# Altium schematic sheet ESP8266_final.SchDoc
size A2; SheetNumber: 1; SheetTotal: 3
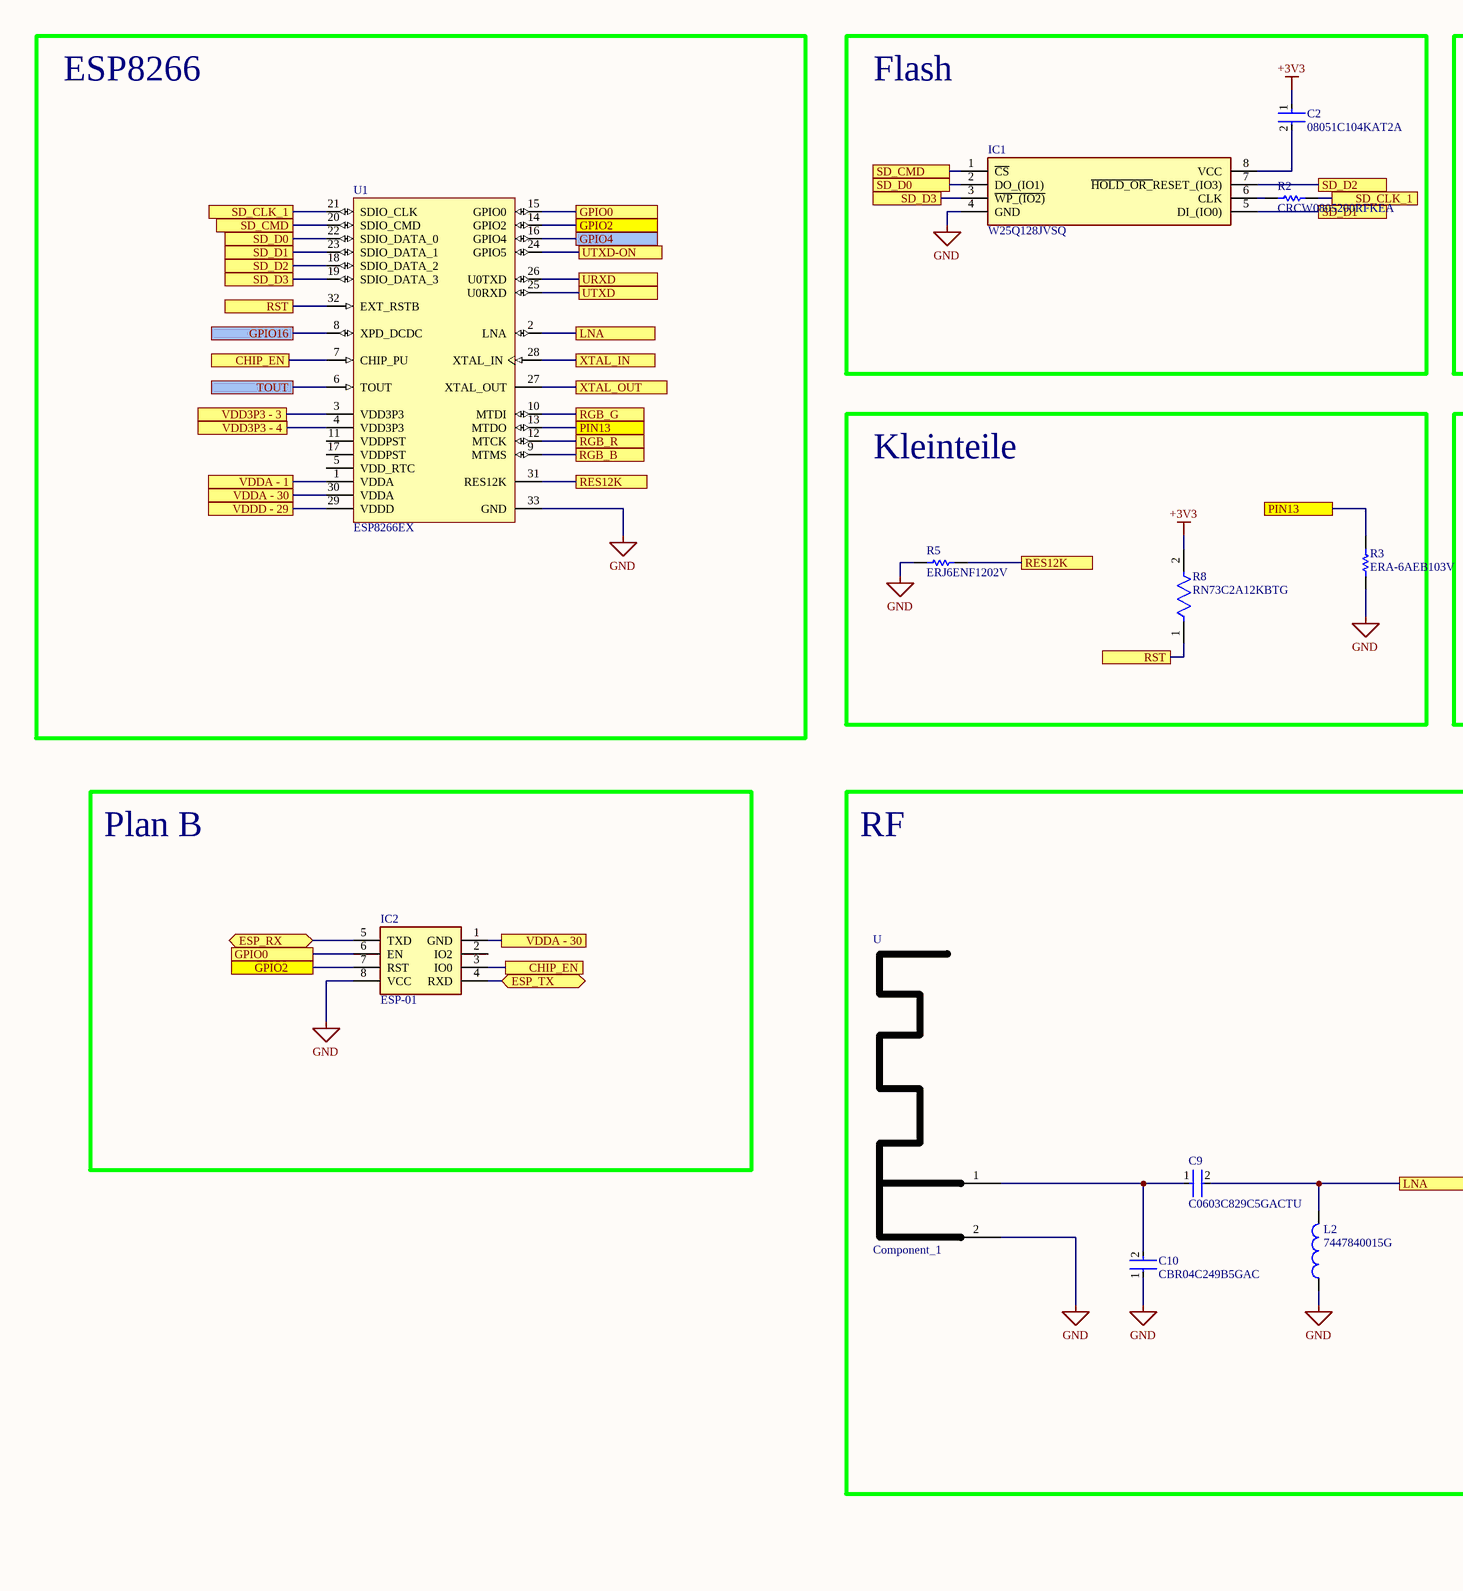
[diagram p0: ESP8266_final.SchDoc, left]
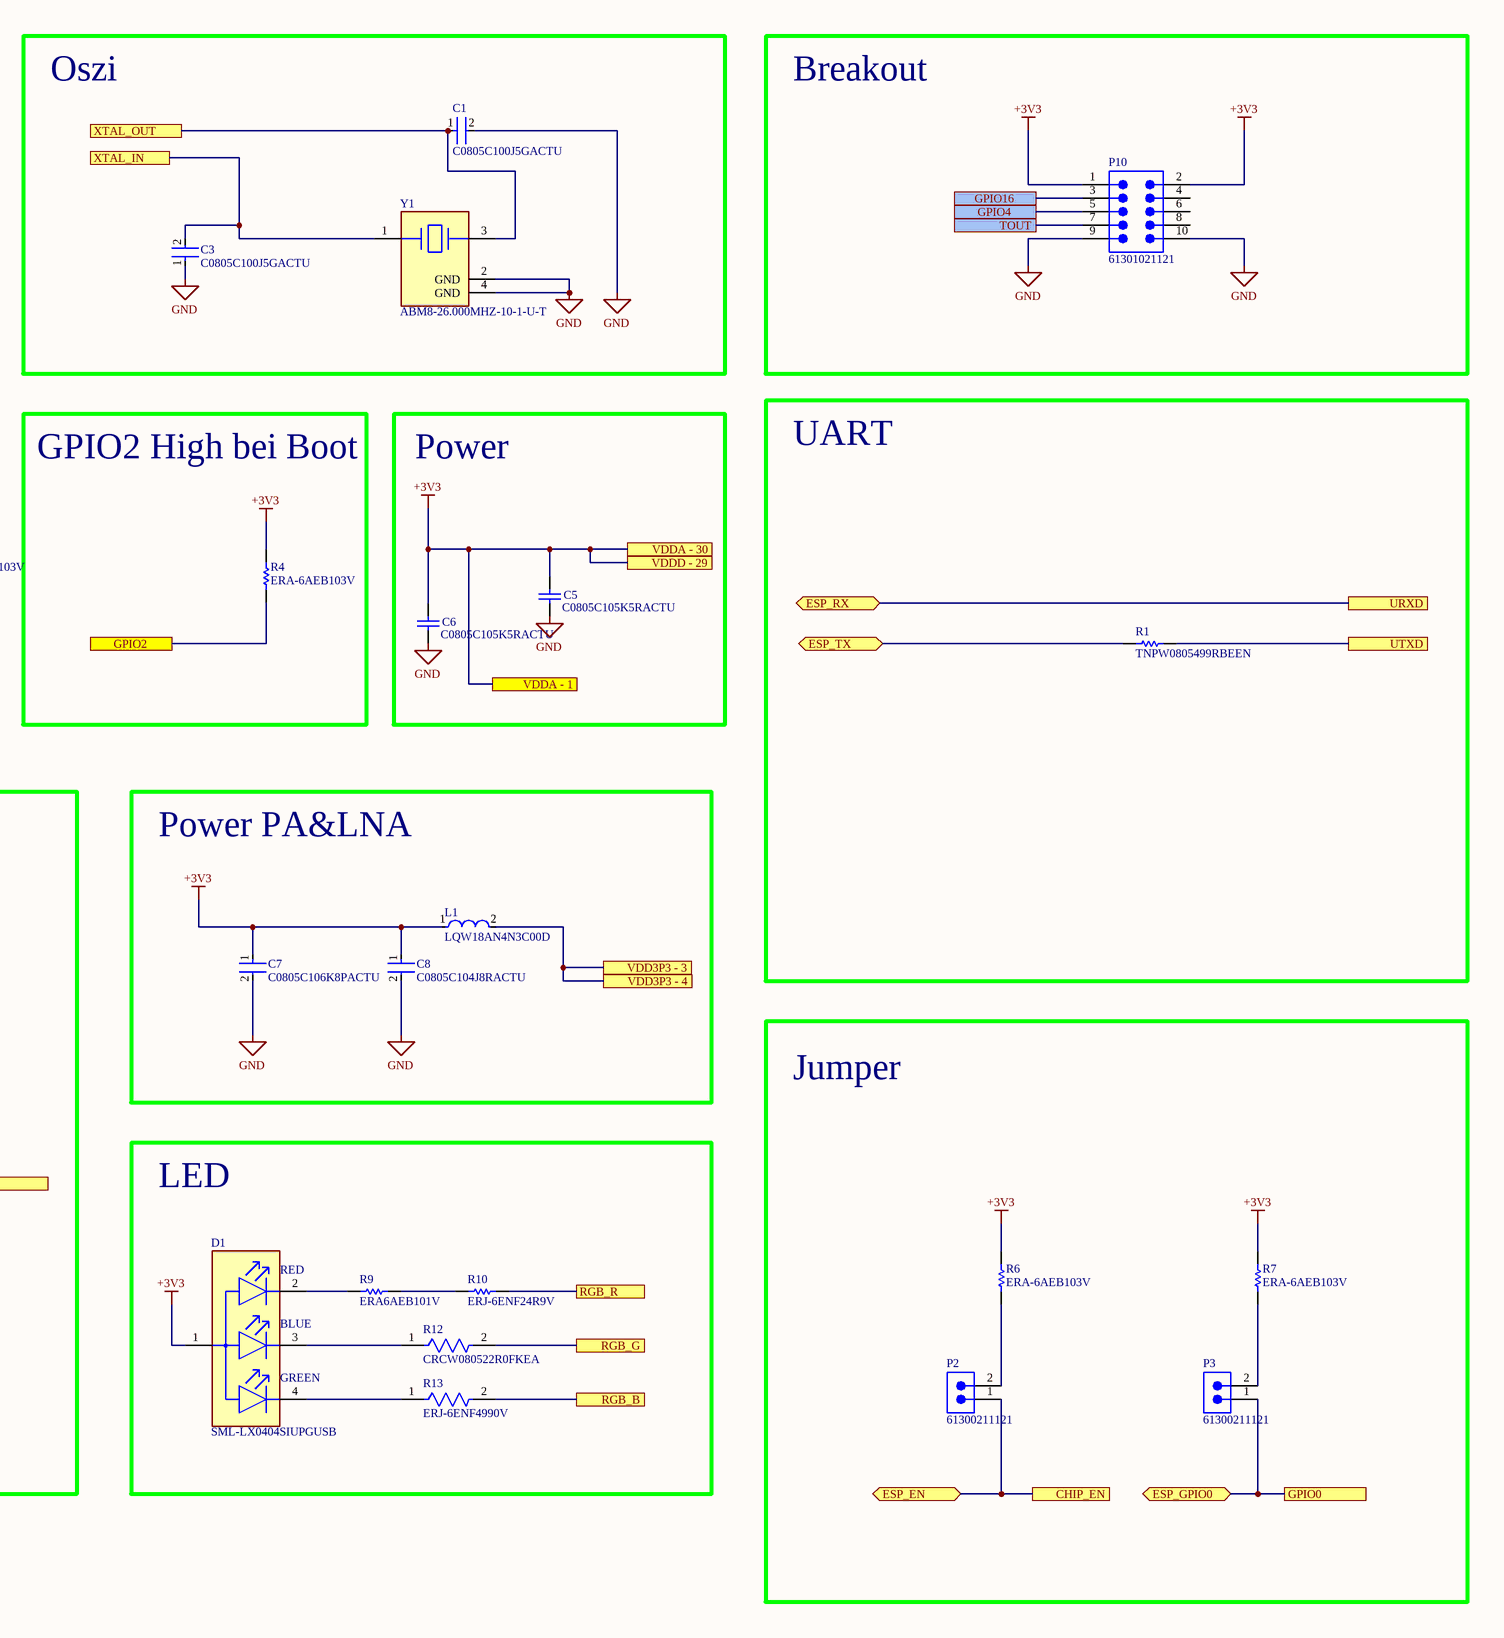
[diagram p1: ESP8266_final.SchDoc, right]

## Parts
C1  C0805C100J5GACTU  [FP-C0805C-DN-MFG]
C2  08051C104KAT2A  [FP-0805-L_2_01_0_2-W_1_25-IPC_B]
C3  C0805C100J5GACTU  [FP-C0805C-DN-MFG]
C5  C0805C105K5RACTU  [CAPC2013X140X50ML20T25]
C6  C0805C105K5RACTU  [CAPC2013X140X50ML20T25]
C7  C0805C106K8PACTU  [FP-C0805C-DG-MFG]
C8  C0805C104J8RACTU  [FP-C0805C-DN-MFG]
C9  C0603C829C5GACTU  [FP-C0603C-CF-MFG]
C10  CBR04C249B5GAC  [FP-CBR04C-MFG]
D1  SML-LX0404SIUPGUSB  [FP-SML-LX0404SIUPGUSB-MFG]
IC1  W25Q128JVSQ  [SOIC127P790X216-8N]
IC2  ESP-01  [ESP01]
L1  LQW18AN4N3C00D  [FP-LQW18AN_00-MFG]
L2  7447840015G  [WE-MK_0402_L1W0.5H0.5]
P2  61300211121  [61300211121]
P3  61300211121  [61300211121]
P10  61301021121  [61301021121]
R1  TNPW0805499RBEEN  [RESC2013X55X40NL15T20]
R2  CRCW0805200RFKEA  [RESC2013X50X30NL20T20]
R3  ERA-6AEB103V  [RESC2013X60X40LL20T25_A]
R4  ERA-6AEB103V  [RESC2013X60X40LL20T25_A]
R5  ERJ6ENF1202V  [RESC2013X70X40ML20T20]
R6  ERA-6AEB103V  [RESC2013X60X40LL20T25_A]
R7  ERA-6AEB103V  [RESC2013X60X40LL20T25_A]
R8  RN73C2A12KBTG  [FP-RN732A-MFG]
R9  ERA6AEB101V  [RESC2013X60X40ML20T25]
R10  ERJ-6ENF24R9V  [RESC2013X70X40ML20T20]
R12  CRCW080522R0FKEA  [FP-CRCW0805-e3-IPC_C]
R13  ERJ-6ENF4990V  [FP-ERJ6EN-IPC_B]
U  Component_1  [PCBComponent_1]
U1  ESP8266EX  [ESFS-QFN-32_L]
Y1  ABM8-26.000MHZ-10-1-U-T  [FP-ABM8-MFG]

## Blocks framed on the sheet
ESP8266: U1
Flash: C2 IC1 R2
Oszi: C1 C3 Y1
Breakout: P10
UART: R1
Kleinteile: R3 R5 R8
GPIO2 High bei Boot: R4
Power: C5 C6
Plan B: IC2
RF: C9 C10 L2 U
Power PA&LNA: C7 C8 L1
Jumper: P2 P3 R6 R7
LED: D1 R9 R10 R12 R13

## Ports
CHIP_EN, ESP_EN (bidir), ESP_GPIO0 (bidir), ESP_RX (bidir), ESP_TX (bidir), GPIO0, GPIO2, GPIO4, GPIO16, LNA, PIN13, RES12K, RGB_B, RGB_G, RGB_R, RST, SD_CLK_1, SD_CMD, SD_D0, SD_D1, SD_D2, SD_D3, TOUT, URXD, UTXD, UTXD-ON, VDD3P3 - 3, VDD3P3 - 4, VDDA - 1, VDDA - 30, VDDD - 29, XTAL_IN, XTAL_OUT

## Nets
+3V3: C2.1 C5.2 C6.2 C7.1 C8.1 D1.1(Common_Anode) IC2.1(GND) L1.1 P10.1 P10.2 R4.2 R6.2 R7.2 R8.2 U1.1(VDDA) U1.29(VDDD) U1.30(VDDA) ; port VDDA - 30, port VDDD - 29, port VDDA - 1
GND: C1.2 C3.1 C5.1 C6.1 C7.2 C8.2 C10.1 IC1.4(GND) IC2.8(VCC) L2.1 P10.9 P10.10 R3.1 R5.1 U.2(GND) U1.33(GND) Y1.2(GND) Y1.4(GND)
CHIP_EN: IC2.3(IO0) P2.1 U1.7(CHIP_PU) ; port CHIP_EN, port ESP_EN
ESP_GPIO0: IC2.6(EN) P3.1 U1.15(GPIO0) ; port GPIO0, port ESP_GPIO0
ESP_RX: IC2.5(TXD) U1.26(U0TXD) ; port URXD, port ESP_RX
ESP_TX: IC2.4(RXD) R1.1 ; port ESP_TX
GPIO2: IC2.7(RST) R4.1 U1.14(GPIO2) ; port GPIO2
GPIO4: P10.5 U1.16(GPIO4) ; port GPIO4
GPIO16: P10.3 U1.8(XPD_DCDC) ; port GPIO16
LNA: C9.2 L2.2 U1.2(LNA) ; port LNA
PIN13: R3.2 U1.13(MTDO) ; port PIN13
RES12K: R5.2 U1.31(RES12K) ; port RES12K
RGB_B: R13.2 U1.9(MTMS) ; port RGB_B
RGB_G: R12.2 U1.10(MTDI) ; port RGB_G
RGB_R: R10.2 U1.12(MTCK) ; port RGB_R
RST: R8.1 U1.32(EXT_RSTB) ; port RST
SD_CLK_1: R2.2 U1.21(SDIO_CLK) ; port SD_CLK_1
SD_CMD: IC1.1(~{CS}) U1.20(SDIO_CMD) ; port SD_CMD
SD_D0: IC1.2(DO_(IO1)) U1.22(SDIO_DATA_0) ; port SD_D0
SD_D1: IC1.5(DI_(IO0)) U1.23(SDIO_DATA_1) ; port SD_D1
SD_D2: IC1.7(~{HOLD_OR_}RESET_(IO3)) U1.18(SDIO_DATA_2) ; port SD_D2
SD_D3: IC1.3(~{WP_(IO2)}) U1.19(SDIO_DATA_3) ; port SD_D3
TOUT: P10.7 U1.6(TOUT) ; port TOUT
UTXD: R1.2 U1.25(U0RXD) ; port UTXD
UTXD-ON: U1.24(GPIO5) ; port UTXD-ON
VDD3P3 - 3: L1.2 U1.3(VDD3P3) U1.4(VDD3P3) ; port VDD3P3 - 3, port VDD3P3 - 4
XTAL_IN: C3.2 U1.28(XTAL_IN) Y1.1 ; port XTAL_IN
XTAL_OUT: C1.1 U1.27(XTAL_OUT) Y1.3 ; port XTAL_OUT
NetC2_2: C2.2 IC1.8(VCC)
NetC9_1: C9.1 C10.2 U.1(LNA)
NetD1_2: D1.2(Red_C) R9.1
NetD1_3: D1.3(Blue_C) R12.1
NetD1_4: D1.4(Green_C) R13.1
NetIC1_6: IC1.6(CLK) R2.1
NetP2_2: P2.2 R6.1
NetP3_2: P3.2 R7.1
NetR9_2: R9.2 R10.1

Not connected (* = marked no-connect by the designer): IC2 2(IO2); P10 4 6 8; U1 5(VDD_RTC) 11(VDDPST) 17(VDDPST)

## Notes on the sheet
- (near D1) RED
- (near D1) BLUE
- (near D1) GREEN

## Library data of the parts
C1 C3 = CMP-2007-00219-2: Capacitor; Ceramic; Cap 10 pF; Tol 5%; Vol-Rtg 50 VDC; SMT; 0805; COG (NPO); Tape&Reel; Manufacturer: KEMET; Value: 10 pF; Temperature Coefficient: 30ppm/°C; Voltage Rating: 50 V; Tolerance: 0.05; Temperature Characteristic: C0G; RoHS: TRUE; Mouser Description: KEMET - C0805C100J5GACTU - CAP, MLCC, C0G/NP0, 10PF, 50V, 0805; Temperature Range High: +125°C; Octopart: https://octopart.com/c0805c100j5gactu-kemet-104357; Automotive: No; Device Class L1: Passive Components; Temperature Range Low: -55°C; Device Class L3: Ceramic Capacitors; Material: Ceramic; Device Class L2: Capacitors; Lead Free: Yes; Manufacturer Part Number: C0805C100J5GACTU; Category: Cap; Ipc Land Pattern Name: CAPC200125X78; ComponentLink2Description: Datasheet; ComponentLink2URL: https://content.kemet.com/datasheets/KEM_C1003_C0G_SMD.pdf; Digikey Description: Capacitor; Ceramic; Cap 10 pF; Tol 5%; Vol-Rtg 50 VDC; SMT; 0805; COG (NPO); Tape&Reel; Temperature: -55°C to +125°C; Height: 0.88mm; Capacitance: 10 pF; Package: C0805C-DN
C2 = CMP-2007-04174-2: General Purpose Ceramic Capacitor, 0805, 100nF, 10%, X7R, 15%, 100V; Packaging: Tape and Reel; Min Operating Temperature: -55°C; Dielectric Material: Ceramic; Height: 1.4mm; Voltage Rating: 100V; Termination: SMD/SMT; Case Code (Imperial): 0805; Case Code (Metric): 2012; Case/Package: 0805; Construction: Flat; Radiation Hardening: No; Series: -; Dielectric: X7R; Package Quantity: 2000; Mount: Surface Mount; Capacitance: 100nF; Contact Plating: Tin; Voltage: 100V; Lead Free: Lead Free; Depth: 1.25mm; RoHS Compliant: Yes; Number of Pins: 2; Max Operating Temperature: 125°C; Length: 2.01mm; Voltage Rating (DC): 100V; Thickness: 0.055inch; REACH SVHC: No SVHC; Width: 0.049inch; Tolerance: 10%
C5 C6 = CMP-2007-03236-1: Manufacturer: Kemet; Part Number: C0805C105K5RACTU
C7 = CMP-2007-03243-2: CAP CER 10UF 10V X5R 0805; Manufacturer: Kemet; 3DS Part Number: 220-00001; Tolerance: 10%; Temperature Coefficient: 15%; Material: Ceramic; Device Class L2: Capacitors; Device Class L1: Passive Components; ComponentLink2URL: https://content.kemet.com/datasheets/KEM_C1006_X5R_SMD.pdf; Height: 1.4mm; Lead Free: Yes; Manufacturer Part Number: C0805C106K8PACTU; Digikey Description: CAP CER 10UF 10V X5R 0805; Octopart: https://octopart.com/c0805c106k8pactu-kemet-98697; Capacitance: 10uF; Value: 10uF; Temperature Range Low: -55°C; Temperature: -55°C to +85°C; Automotive: No; Mouser Description: CAP CER 10UF 10V X5R 0805; Ipc Land Pattern Name: CAPC200125X125; Temperature Range High: +85°C; Voltage: 10V; RoHS: TRUE; Device Class L3: Ceramic Capacitors; ComponentLink2Description: Datasheet; Voltage Rating: 10V; Package: C0805C-DG; Temperature Characteristic: X5R; Category: Cap
C8 = CMP-03020-032188-1: CAP CER 0.1UF 10V 5% X7R 0805; Manufacturer: KEMET; Material: Ceramic; Tolerance: 0.05; Capacitance: 0.10 μF; Temperature Coefficient: 30ppm/°C; Value: 0.10 μF; Package: C0805C-DN; Device Class L1: Passive Components; Temperature: -55°C to +125°C; Category: Cap; RoHS: TRUE; Mouser Description: Multilayer Ceramic Capacitors MLCC - SMD/SMT 10volts 0.1uF X7R 5%; Lead Free: Yes; Temperature Range Low: -55°C; Temperature Range High: +125°C; Device Class L2: Capacitors; Temperature Characteristic: X7R; Device Class L3: Ceramic Capacitors; ComponentLink2Description: Datasheet; Automotive: No; Ipc Land Pattern Name: CAPC200125X78; Manufacturer Part Number: C0805C104J8RACTU; Voltage Rating: 10 V; Height: 0.88mm; Digikey Description: CAP CER 0.1UF 10V 5% X7R 0805; Octopart: https://octopart.com/c0805c104j8ractu-kemet-11807087; ComponentLink2URL: https://content.kemet.com/datasheets/KEM_C1003_C0G_SMD.pdf
C9 = CMP-2006-03332-2: CAP CER 8.2PF 50V NP0 0603; Manufacturer: KEMET; Temperature Coefficient: 30ppm/°C; Temperature Characteristic: C0G; Material: Ceramic; Tolerance: 0.25 pF; Automotive Grade: Grade 1; Octopart: https://octopart.com/c0603c829c5gactu-kemet-8375751; Automotive: Yes; RoHS: TRUE; Manufacturer Part Number: C0603C829C5GACTU; Temperature Range High: +125°C; Category: Cap; Digikey Description: CAP CER 8.2PF 50V NP0 0603; Value: 8.2 pF; Temperature: -55°C to +125°C; Package: C0603C-CF; Device Class L1: Passive Components; Device Class L3: Ceramic Capacitors; Device Class L2: Capacitors; ComponentLink2Description: Datasheet; Height: 0.87mm; Capacitance: 8.2 pF; Lead Free: Yes; Voltage Rating: 50 V; Mouser Description: Multilayer Ceramic Capacitors MLCC - SMD/SMT 50volts 8.2pF C0G 0.25%; ComponentLink2URL: https://api.kemet.com/component-edge/download/datasheet/C0603C100J5GACAUTO.pdf; Temperature Range Low: -55°C
C10 = CMP-03020-011124-1: CBR0402 2.4 pF 30ppm/°C 0.1 pF C0G 50 V; Manufacturer: KEMET; Capacitance: 2.4 pF; Material: Ceramic; Tolerance: 0.1 pF; Value: 2.4 pF; Voltage Rating: 50 V; Ipc Land Pattern Name: CAPC10050X50; Device Class L3: Ceramic Capacitors; ComponentLink2Description: Datasheet; Category: Cap; Octopart: https://octopart.com/cbr04c249b5gac-kemet-75200062; Temperature Characteristic: C0G; ComponentLink2URL: https://content.kemet.com/datasheets/KEM_C1030_CBR_SMD.pdf; Height: 0.55mm; RoHS: TRUE; Manufacturer Part Number: CBR04C249B5GAC; Package: CBR04C; Temperature Range High: +125°C; Temperature Range Low: -55°C; Temperature: -55°C to +125°C; Device Class L2: Capacitors; Temperature Coefficient: 30ppm/°C; Automotive: No; Lead Free: Yes; Device Class L1: Passive Components
D1 = CMP-2000-07119-2: LED RGB CLEAR SMD; Test Current: 2mA; Wavelength: 465nm; Color: Blue; Lens Style: Square; Power Rating: 30mW; Lens Color: Colorless; Number of LEDs: 3; Viewing Angle: 120°; Luminous Intensity: 20mcd; Forward Voltage: 2.73V; Height: 0.3mm; Lead Free: Lead Free; Max Operating Temperature: 85°C; Mount: Surface Mount; REACH SVHC: No SVHC; Case Code (Imperial): 0404; Forward Current: 2mA; Case Code (Metric): 1010; Lens Transparency: Clear; Length: 1mm; Packaging: Tape and Reel; Min Operating Temperature: -40°C; Package Quantity: 2000; Case/Package: 0404; Width: 1mm
IC1 = W25Q128JVSQ: Integrated Circuit; Manufacturer_Name: Winbond; Datasheet Link: https://www.winbond.com/hq/support/documentation/levelOne.jsp?__locale=en&DocNo=DA00-W25Q128JV; Height: 2.16mm; Manufacturer_Part_Number: W25Q128JVSQ
IC2 = ESP-01: Integrated Circuit; Manufacturer_Name: Ai-Thinker; Datasheet Link: https://docs.ai-thinker.com/_media/esp8266/docs/esp-01_product_specification_en.pdf; Manufacturer_Part_Number: ESP-01
L1 = CMP-06042-008021-1: Wire Wound RF Inductor 4.3nH ±0.2nH 850mA 0.059Ω 0603 (1608); Self Resonant Frequency: 6GHz; Series Resistance: 59mR; Shielding: Unshielded; Test Frequency: 100MHz; Current: 750mA; Core Material: Non-Magnetic; Q Factor: 35; Case Code (Imperial): 0603; Mount: Surface Mount; Radiation Hardening: No; Height: 0.8mm; Width: 0.031inch; Length: 1.6mm; Height - Seated (Max): 0.039inch; Current Rating: 850mA; Resistor Type: Wirewound; Package Quantity: 4000; Depth: 1mm; DC Resistance (DCR): 59mR; Termination: SMD/SMT; Max Operating Temperature: 125°C; Military Standard: Not; Min Operating Temperature: -55°C; Case Code (Metric): 1608; DC Current: 850mA; Packaging: Tape and Reel; Inductance: 4.3nH; Max DC Current: 850mA; REACH SVHC: No SVHC; Case/Package: 0603; Weight: 0.000106oz
L2 = CMP-03913-120013755-1: 7447840015G Multilayer Inductor, 1.5Nh, 0.3A, 0402 Rohs Compliant: Yes; Current Rating: 300mA; Width: 500µm; Length: 1mm; Height: 500µm; Max Operating Temperature: 125°C; RoHS: Compliant; Ambient Temperature Range High: 105°C; NexarPartId: 120013755; Inductance: 1.5nH; Ambient Temperature Range Low: -55°C; Min Operating Temperature: -55°C
P2 P3 = CMP-1712-00002-6: NexarPartId: 20081794; Number of Contacts: 2; Pitch: 2.54mm; Connector Type: Male Pin; Voltage Rating: 250V; Current Rating: 3A; Gender: Male; Contact Resistance: 20mΩ; Height: 8.94mm; Lead Free: Lead Free; Number of Pins: 2; Termination: Through Hole; RoHS: Compliant; Lead Pitch: 2.54mm; REACH SVHC: No SVHC; Housing Material: PBT; Contact Mating Length: 5.9944mm; Min Operating Temperature: -40°C; Orientation: Vertical; Contact Material: Copper; Contact Gender: Male; Max Operating Temperature: 125°C; Number of Rows: 1; Number of Positions: 2; Packaging: Bulk; Contact Plating: Gold; Mount: Through Hole; Color: Black; Operating Supply Voltage: 250V
P10 = CMP-1502-01084-3: NexarPartId: 18818163; Connector Type: Male Pin; Insulation Resistance: 1GΩ; Row Spacing: 2.54mm; Insulation: Insulated; Number of Positions: 10; Current Rating: 3A; Voltage Rating: 250V; Gender: Male; Contact Resistance: 20mΩ; Contact Gender: Male; Number of Rows: 2; Min Operating Temperature: -40°C; Mount: Through Hole; Packaging: Bulk; Length: 12.7mm; Pitch: 2.54mm; RoHS: Compliant; Height: 2.54mm; Lead Pitch: 2.54mm; Number of Pins: 10; Housing Material: PBT; Orientation: Vertical; Flammability Rating: UL94 V-0; Termination: Through Hole; Width: 12.7mm; Color: Black; Contact Mating Length: 5.9944mm; Max Operating Temperature: 105°C; Operating Supply Voltage: 250V; Contact Material: Copper; Number of Contacts: 10; Contact Plating: Gold; REACH SVHC: Unknown
R1 = CMP-2001-04775-1: Manufacturer: Vishay Dale; Part Number: TNPW0805499RBEEN
R2 = CMP-2001-03663-1: Manufacturer: Vishay Dale; Part Number: CRCW0805200RFKEA
R3 R4 R6 R7 = CMP-2001-00582-2: Metal Film Chip Resistor, High Reliability Type, 0.125 W, +/- 0.1%, -55 to 155 degC, 0805 (2012 Metric), RoHS, Tape and Reel; Voltage Rating: 100V; Power Rating: 125mW(1/8W); Brand: Panasonic; Temperature Coefficient: 25PPM/C; Resistance: 10kOhms; Product Category: ThinFilmResistors-SMD; Datasheet Version: 02/2016; Operating Temperature Range: -55Cto+155C; Length: 2mm; Mounting Technology: SurfaceMount; Manufacturer URL: http://www.panasonic.com/; Width: 1.25mm; Packaging: Reel; Product: ThinFilmResistorsSMD; Package / Case: 0805(2012metric); Termination Style: SMD/SMT; Tolerance: 0.1%; Datasheet URL: https://industrial.panasonic.com/cdbs/www-data/pdf/RDM0000/AOA0000C307.pdf; Package Description: 2-Pin Surface Mount Device, Body 2 x 1.25 mm; Factory Pack Quantity: 5000; Series: ERA-6A; Case Code - mm: 2012; RoHS: Details; Package Reference: 0805; Height: 0.5mm; Manufacturer: Panasonic; Case Code - in: 0805; Type: MetalFilmChipResistors
R5 = CMP-2001-00513-1: Manufacturer: Panasonic; Part Number: ERJ6ENF1202V
R8 = CMP-03211-006924-1: SMD Chip Resistor, Thin Film, 12KΩ, 100 V, 0805 [2012 Metric], 100 mW, 0.1%, RN73 Series; Manufacturer: TE Connectivity; Power Rating: 0.1W; Temperature Coefficient: 10ppm/°C; Voltage Rating: 100V; Device Class L1: Passive Components; Device Class L2: Resistors; RoHS: TRUE; Temperature Range Low: -55°C; Tolerance: 0.1%; Temperature: -55°C to 155°C; Value: 12KΩ; packaging: 250 cut tape length; Lead Free: Yes; Height: 0.65mm; Ipc Land Pattern Name: RESC200125X55; Automotive: No; Category: Res; ComponentLink2Description: Datasheet; Device Class L3: Chip SMD Resistors; Manufacturer Part Number: RN73C2A12KBTG; Series: RN73; Temperature Range High: 155°C; octopart_url: https://octopart.com/rn73c2a12kbtg-te+connectivity-22737727; Package: RN732A; ComponentLink2URL: https://www.te.com/commerce/DocumentDelivery/DDEController?Action=showdoc&DocId=Data+Sheet%7F1773270%7FP%7Fpdf%7FEnglish%7FENG_DS_1773270_P.pdf%7F1676162-2; Resistance: 12KΩ; Octopart: https://octopart.com/rn73c2a12kbtg-te+connectivity-22737727; Composition: Thin Film
R9 = CMP-2001-00580-1: Manufacturer: Panasonic; Part Number: ERA6AEB101V
R10 = CMP-2001-00076-1: Manufacturer: Panasonic; Part Number: ERJ-6ENF24R9V
R12 = CMP-2001-03692-2: RES Thick Film, 22Ω, 1%, 0.125W, 100ppm/°C, 0805; Resistance: 22R; Power Rating: 125mW; Voltage Rating: 150V; Case/Package: 0805; Radiation Hardening: No; Number of Terminations: 2; Termination: SMD/SMT; Package Quantity: 5000; Weight: 0.000194oz; Mount: Surface Mount; Lead Free: Lead Free; Height: 0.45mm; Composition: Thick Film; Min Operating Temperature: -55°C; Case Code (Metric): 2012; Temperature Coefficient: 100ppm/°C; Depth: 1.25mm; Packaging: Tape and Reel; Contact Plating: Tin; Width: 1.25mm; Case Code (Imperial): 0805; Length: 2mm; Max Operating Temperature: 155°C; Tolerance: 1%; Features: Automotive AEC-Q200; Military Standard: Not; Voltage Rating (DC): 150V; Max Power Dissipation: 125mW
R13 = CMP-2001-00211-2: RES SMD 499 OHM 1% 1/8W 0805; Temperature Coefficient: 100ppm/°C; Working Voltage: 150V; Power Rating: 125mW; Resistance: 499R; Case/Package: 0805; Mount: Surface Mount; Height: 0.6mm; Resistor Type: Thick Film; Length: 2mm; Depth: 1.25mm; Tolerance: 1%; REACH SVHC: No SVHC; RoHS Compliant: Yes; Case Code (Imperial): 0805; Min Operating Temperature: -55°C; Contact Plating: Tin; Lead Free: Lead Free; Construction: Rectangular; Technology: THICK FILM; Termination: SMD/SMT; Features: Automotive AEC-Q200; Case Code (Metric): 2012; Resistance Tolerance: 1%; Voltage Rating: 150V; Max Operating Temperature: 155°C; Series: ERJ; Packaging: Tape and Reel; Radiation Hardening: No; Military Standard: Not; Voltage Rating (DC): 150V; Package Quantity: 1; Max Power Dissipation: 125mW; Number of Terminations: 2; Width: 0.049inch
U1 = CMP-2000-07453-1: Low-Power, Highly-Integrated Wi-Fi Solution, 2.5 to 3.6 V, 80 mA, -40 to 125 degC, 32-Pin QFN; Manufacturer: Espressif Systems; Mounting Technology: SurfaceMount; Datasheet URL: http://espressif.com/sites/default/files/documentation/0a-esp8266ex_datasheet_en.pdf; Package Reference: QFN-32; Package Description: 32-Pin Quad Falt No-Lead, Body 5 x 5 mm, Pitch 0.5 mm; Manufacturer URL: http://espressif.com; Datasheet Version: Rev. 5.4, 04/2017
Y1 = CMP-27762-002739-1: Crystal 26MHz ±10ppm 10pF SMD-4 3.2mm x 2.5mm; ESR (Equivalent Series Resistance): 50R; Width: 2.5mm; Min Operating Temperature: -10°C; Max Operating Temperature: 60°C; Packaging: Tape and Reel; Resistor Type: Ceramic; Frequency Tolerance: 10ppm; Package Quantity: 1000; Case/Package: CSMD; Depth: 2.5mm; REACH SVHC: No SVHC; Load Capacitance: 10pF; Lead Free: Lead Free; Mount: Surface Mount; Termination: SMD/SMT; Number of Pins: 4; Series Resistance: 50R; Operating Frequency: 26 MHz; Tolerance: 10ppm; Frequency Stability: 10ppm; Frequency: 26MHz; Series: ABM8; Height: 0.031inch; Length: 3.2mm